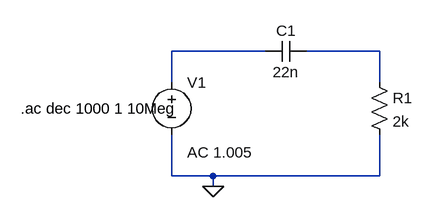
[diagram p0: schematic circuit1.asc]
circuit1.asc, the LTspice schematic file:
Version 4.1
SHEET 1 880 680
WIRE 224 64 80 64
WIRE 400 64 288 64
WIRE 80 112 80 64
WIRE 400 112 400 64
WIRE 80 256 80 192
WIRE 144 256 80 256
WIRE 400 256 400 192
WIRE 400 256 144 256
WIRE 144 272 144 256
FLAG 144 272 0
SYMBOL voltage 80 96 R0
WINDOW 123 24 124 Left 2
WINDOW 39 0 0 Left 0
SYMATTR Value2 AC 1.005
SYMATTR InstName V1
SYMATTR Value ""
SYMBOL cap 288 48 R90
WINDOW 0 0 32 VBottom 2
WINDOW 3 32 32 VTop 2
SYMATTR InstName C1
SYMATTR Value 22n
SYMBOL res 384 96 R0
SYMATTR InstName R1
SYMATTR Value 2k
TEXT -152 152 Left 2 !.ac dec 1000 1 10Meg

The netlist it stands for:
* circuit1.asc
V1 N001 0 AC 1.005
C1 N002 N001 22n
R1 N002 0 2k
.ac dec 1000 1 10Meg
.backanno
.end